# Altium schematic sheet 12V_FROM_BATTERY.SchDoc: DARKYDEN_12V_FROM_BATTERY
size Letter; ApprovedBy: APPROUVÉ PAR; Author: Harold Malbrouck; Organization: Cegep Limoilou; Address1: 1300, 8e Avenue; Address2: Québec, QC; Address3: Canada; Address4: G1J 5L5; Revision: Rev.A; SheetNumber: 18; SheetTotal: 22
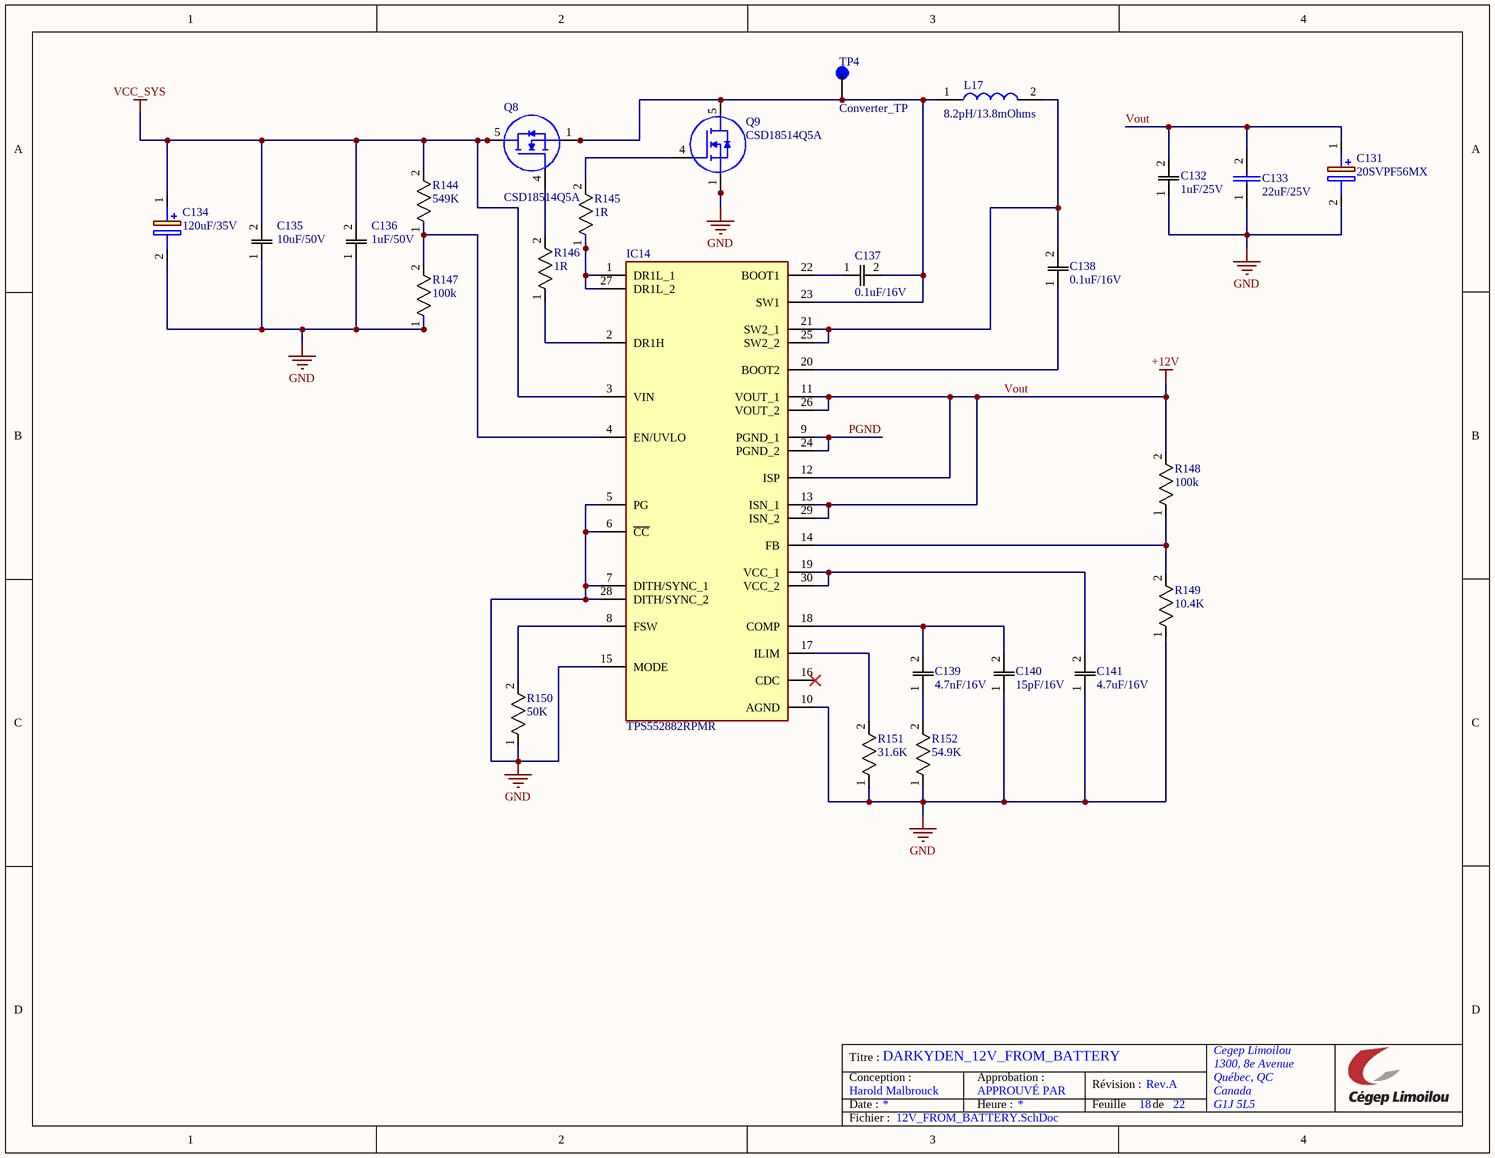
[diagram p0: 12V_FROM_BATTERY.SchDoc]

## Parts
C131  20SVPF56MX  [16SVF82M]
C132  1uF/25V  [C0805]
C133  22uF/25V  [CAPC3225X270N]
C134  120uF/35V  [16SVF1000M]
C135  10uF/50V  [CAPC3225X230N]
C136  1uF/50V  [CAPC1608X80N]
C137  0.1uF/16V  [CAPC220145_88N_KEM]
C138  0.1uF/16V  [CAPC220145_88N_KEM]
C139  4.7nF/16V  [CAPC220145_88N_KEM]
C140  15pF/16V  [CAPC220145_88N_KEM]
C141  4.7uF/16V  [C0805]
IC14  TPS552882RPMR  [TPS552882RPMR]
L17  8.2pH/13.8mOhms  [INDPM135126X650N]
Q8  CSD18514Q5A  [CSD18514Q5A]
Q9  CSD18514Q5A  [CSD18514Q5A]
R144  549K  [RC0603N_PAN]
R145  1R  [ERJ3EKF1000V]
R146  1R  [ERJ3EKF1000V]
R147  100k  [ERJ3EKF1000V]
R148  100k  [ERJ3EKF1000V]
R149  10.4K  [RC0603N_PAN]
R150  50K  [RESC1005X40N]
R151  31.6K  [RESC1005X40N]
R152  54.9K  [RESC1005X40N]
TP4  Converter_TP  [KEYSTONE_5006]

## Nets
GND: C131.2(-) C132.1 C133.1 C134.2(-) C135.1 C136.1 C140.1 C141.1 IC14.5(PG) IC14.6(~{CC}) IC14.7(DITH/SYNC_1) IC14.10(AGND) IC14.15(MODE) IC14.28(DITH/SYNC_2) R147.1 R149.1 R150.1 R151.1 R152.1
VCC_SYS: C134.1(+) C135.2 C136.2 IC14.3(VIN) Q8.5(D) Q8.6(D_2) Q8.7(D_3) Q8.8(D_4) Q8.9(D_5) R144.2
Vout: C131.1(+) C132.2 C133.2 IC14.11(VOUT_1) IC14.12(ISP) IC14.13(ISN_1) IC14.26(VOUT_2) IC14.29(ISN_2) R148.2  [also labelled +12V]
PGND: IC14.9(PGND_1) IC14.24(PGND_2)
NetC137_1: C137.1 IC14.22(BOOT1)
NetC137_2: C137.2 IC14.23(SW1) L17.1 Q8.1(S) Q8.2(S_2) Q8.3(S_3) Q9.5(D) Q9.6(D_2) Q9.7(D_3) Q9.8(D_4) Q9.9(D_5) TP4.TP
NetC138_1: C138.1 IC14.20(BOOT2)
NetC138_2: C138.2 IC14.21(SW2_1) IC14.25(SW2_2) L17.2
NetC139_1: C139.1 R152.2
NetC139_2: C139.2 C140.2 IC14.18(COMP)
NetC141_2: C141.2 IC14.19(VCC_1) IC14.30(VCC_2)
NetIC14_1: IC14.1(DR1L_1) IC14.27(DR1L_2) R145.1
NetIC14_2: IC14.2(DR1H) R146.1
NetIC14_4: IC14.4(EN/UVLO) R144.1 R147.2
NetIC14_8: IC14.8(FSW) R150.2
NetIC14_14: IC14.14(FB) R148.1 R149.2
NetIC14_17: IC14.17(ILIM) R151.2
NetQ8_4: Q8.4(G) R146.2
NetQ9_1: Q9.1(S) Q9.2(S_2) Q9.3(S_3)
NetQ9_4: Q9.4(G) R145.2

Not connected (* = marked no-connect by the designer): IC14 16(CDC)*

## Notes on the sheet
- Titre :
- Conception :
- Date :
- Approbation :
- Heure :
- Révision :
- Feuille
- de
- Fichier :

## Library data of the parts
C131 = 20SVPF56MX: 56uF 20VDC 20%( Cap Aluminum Polymer SMD 0.03 Ohm 2800mA 5000h 105C T/R; Manufacturer_Name: Panasonic; ESR (Equivalent Series Resistance): 30mR; Ripple Current: 2.8A; Voltage Rating: 20V; Leakage Current: 224uA; Life (Hours): 5000Hour; Dissipation Factor: 12%; Datasheet Link: http://industrial.panasonic.com/cdbs/www-data/pdf/AAB8000/AAB8000C177.pdf; Height: 6mm; Manufacturer_Part_Number: 20SVPF56MX; Mouser Part Number: 667-20SVPF56MX; Mouser Price/Stock: https://www.mouser.co.uk/ProductDetail/Panasonic/20SVPF56MX?qs=OE1iw1LrrPFJ8spd6yzaew%3D%3D; Arrow Part Number: 20SVPF56MX; Arrow Price/Stock: https://www.arrow.com/en/products/20svpf56mx/panasonic?region=nac; Supplier: Digikey; Supplier Part Number: P16502CT-ND; Manufacturer: Panasonic; Manufacturer Part Number: 20SVPF56MX; RoHS: Yes; Category: Polymer Capacitors; Stock: 2410; Pricing: 1=0.84, 10=0.481, 50=0.473, 100=0.453, 500=0.407 (USD); Mounting Technology: Surface Mount; Case/Package: Radial; Pins: 6; Min Operating Temperature: -55°C; Max Operating Temperature: 105°C; Value: 56uF; Tolerance: 20%; Packaging: Tape and Reel; Ripple Current (AC): 2.8A; Package Quantity: 1500; Voltage Rating (DC): 20V; Termination: SMD/SMT; Voltage: 20V; Series: OS-CON™, SVPF; Diameter: 5mm; Length: 5.9mm; Reach SVHC Compliant: No; RoHS Compliant: Yes; ComponentLink1URL: https://datasheet.ciiva.com/25746/1734360-25746730.pdf?src-supplier=Farnell; ComponentLink1Description: https://datasheet.ciiva.com/25746/1734360-25746730.pdf?src-supplier=Farnell; ComponentLink2URL: https://datasheet.ciiva.com/24066/svpf-os-262415-24066271.pdf?src-supplier=Mouser; ComponentLink2Description: https://datasheet.ciiva.com/24066/svpf-os-262415-24066271.pdf?src-supplier=Mouser; ComponentLink3URL: https://datasheet.ciiva.com/48542/svpf-eng-ds-48542383.pdf?src-supplier=Distrelec; ComponentLink3Description: https://datasheet.ciiva.com/48542/svpf-eng-ds-48542383.pdf?src-supplier=Distrelec
C132 = C0805C105K3RACTU: 1 µF, 25 V (DC), ±10 %, SMD 0805, X7R, C0805C105K3RAC7800; Manufacturer_Name: KEMET; Dielectric Material: Ceramic; Material: 4241ConductorMaterial; Value: 1uF; Tolerance: 10%; Voltage: 25V; Datasheet Link: https://content.kemet.com/datasheets/KEM_C1002_X7R_SMD.pdf; Height: 1.1mm; Manufacturer_Part_Number: C0805C105K3RACTU; Mouser Part Number: 80-C0805C105K3R; Mouser Price/Stock: https://www.mouser.co.uk/ProductDetail/KEMET/C0805C105K3RACTU?qs=7V%2FSUxyM1Kfm2X%2FN09twSA%3D%3D; Arrow Part Number: C0805C105K3RACTU; Arrow Price/Stock: https://www.arrow.com/en/products/c0805c105k3ractu/kemet-corporation?region=nac; Supplier: Digikey; Supplier Part Number: 399-C0805C105K3RACTUCT-ND; Manufacturer: KEMET; Manufacturer Part Number: C0805C105K3RACTU; RoHS: Yes; Category: Ceramic Capacitors; Stock: 127373; Pricing: 1=0.61, 10=0.498, 100=0.376, 1000=0.30337 (USD); Mounting Technology: Surface Mount; Case/Package: 0805; Pins: 2; Case Code (Imperial): 0805; Case Code (Metric): 2012; Min Operating Temperature: -55°C; Max Operating Temperature: 125°C; Dielectric: X7R; Packaging: Tape and Reel; Termination: SMD/SMT; Package Quantity: 2500; Voltage Rating: 25V; Voltage Rating (DC): 25V; Series: C; Construction: Flat; Length: 2mm; Width: 0.049inch; Depth: 1.25mm; Thickness: 0.055inch; Radiation Hardening: No; Reach SVHC Compliant: No; RoHS Compliant: Yes
C133 = GRM32ER61E226KE15L: 1210 22 uF 25 V ±10% Tolerance X5R SMT Multilayer Ceramic Capacitor; Manufacturer_Name: Murata Electronics; Manufacturer: Murata; Value: 22uF; Voltage Rating: 25V; Datasheet Link: https://search.murata.co.jp/Ceramy/image/img/A01X/G101/ENG/GRM32ER61E226KE15-01A.pdf; Height: 2.7mm; Manufacturer_Part_Number: GRM32ER61E226KE15L; Mouser Part Number: 81-GRM32ER61E226KE15; Mouser Price/Stock: https://www.mouser.co.uk/ProductDetail/Murata-Electronics/GRM32ER61E226KE15L?qs=CHiu0TXTCq%252Bo%252Bcqcz70txw%3D%3D; Arrow Part Number: GRM32ER61E226KE15L; Arrow Price/Stock: https://www.arrow.com/en/products/grm32er61e226ke15l/murata-manufacturing?utm_currency=USD&region=nac; Supplier: Digikey; Supplier Part Number: 490-3889-1-ND; Manufacturer Part Number: GRM32ER61E226KE15L; RoHS: Yes; Category: Ceramic Capacitors; Stock: 470491; Pricing: 1=1.44, 10=1.213, 100=0.9457 (USD); Mounting Technology: Surface Mount; Case/Package: 1210; Pins: 2; Case Code (Metric): 3225; Case Code (Imperial): 1210; Material: Ceramic; Min Operating Temperature: -55°C; Max Operating Temperature: 85°C; Package Quantity: 1; Tolerance: 10%; Packaging: Tape and Reel; Voltage Rating (DC): 25V; Dielectric: X5R; Termination: SMD/SMT; Voltage: 25V; Series: GRM; Construction: Flat; Length: 3.2mm; Width: 2.5mm; Thickness: 0.106inch; Depth: 2.5mm; Reach SVHC Compliant: No; Lead Free: Lead Free; RoHS Compliant: Yes; ComponentLink1URL: https://datasheet.ciiva.com/143/product-143250.pdf?src-supplier=Digikey; ComponentLink1Description: https://datasheet.ciiva.com/143/product-143250.pdf?src-supplier=Digikey; ComponentLink2URL: https://datasheet.ciiva.com/3777/2725grm32er61e226ke1523-3777196.pdf?src-supplier=Arrow+Electronics; ComponentLink2Description: https://datasheet.ciiva.com/3777/2725grm32er61e226ke1523-3777196.pdf?src-supplier=Arrow+Electronics; ComponentLink3URL: https://datasheet.ciiva.com/11787/0900766b80ef921d-11787889.pdf?src-supplier=Rs; ComponentLink3Description: https://datasheet.ciiva.com/11787/0900766b80ef921d-11787889.pdf?src-supplier=Rs; ComponentLink4URL: https://datasheet.ciiva.com/143/grm32er61e226ke15-01-143251.pdf?src-supplier=Digikey; ComponentLink4Description: https://datasheet.ciiva.com/143/grm32er61e226ke15-01-143251.pdf?src-supplier=Digikey; ComponentLink5URL: https://datasheet.ciiva.com/143/grm32er61e226ke15-01-143252.pdf?src-supplier=Digikey; ComponentLink5Description: https://datasheet.ciiva.com/143/grm32er61e226ke15-01-143252.pdf?src-supplier=Digikey; ComponentLink6URL: https://datasheet.ciiva.com/2989/product-2989817.pdf?src-supplier=Avnet; ComponentLink6Description: https://datasheet.ciiva.com/2989/product-2989817.pdf?src-supplier=Avnet; ComponentLink7URL: https://datasheet.ciiva.com/2989/product-2989818.pdf?src-supplier=Avnet; ComponentLink7Description: https://datasheet.ciiva.com/2989/product-2989818.pdf?src-supplier=Avnet; ComponentLink8URL: https://datasheet.ciiva.com/16348/l0006e-16348889.pdf?src-supplier=Future+Electronics; ComponentLink8Description: https://datasheet.ciiva.com/16348/l0006e-16348889.pdf?src-supplier=Future+Electronics; ComponentLink9URL: https://datasheet.ciiva.com/7719/608985-7719195.pdf?src-supplier=Element14; ComponentLink9Description: https://datasheet.ciiva.com/7719/608985-7719195.pdf?src-supplier=Element14; ComponentLink10URL: https://datasheet.ciiva.com/14116/grmseries-highdielectrictype-eng-14116379.pdf?src-supplier=Distrelec; ComponentLink10Description: https://datasheet.ciiva.com/14116/grmseries-highdielectrictype-eng-14116379.pdf?src-supplier=Distrelec; ComponentLink11URL: https://datasheet.ciiva.com/22706/608985-22706873.pdf?src-supplier=Element14; ComponentLink11Description: https://datasheet.ciiva.com/22706/608985-22706873.pdf?src-supplier=Element14
C134 = 35SVPF120M: 120uF 35VDC 20% Cap Aluminum Polymer   SMD 0.018 Ohm 4400mA 5000h 105C T/R; Manufacturer_Name: Panasonic; Voltage Rating: 35V; ESR (Equivalent Series Resistance): 18mR; Ripple Current: 4.4A; Leakage Current: 840uA; Life (Hours): 5000Hour; Dissipation Factor: 12%; Datasheet Link: http://industrial.panasonic.com/cdbs/www-data/pdf/AAB8000/AAB8000C177.pdf; Height: 12.7mm; Manufacturer_Part_Number: 35SVPF120M; Mouser Part Number: 667-35SVPF120M; Mouser Price/Stock: https://www.mouser.co.uk/ProductDetail/Panasonic/35SVPF120M?qs=OE1iw1LrrPEMtY1ZtoIEvg%3D%3D; Arrow Part Number: 35SVPF120M; Arrow Price/Stock: https://www.arrow.com/en/products/35svpf120m/panasonic?utm_currency=USD&region=nac; Supplier: Digikey; Supplier Part Number: P16559CT-ND; Manufacturer: Panasonic; Manufacturer Part Number: 35SVPF120M; RoHS: Yes; Category: Polymer Capacitors; Stock: 8642; Pricing: 1=2.52, 10=1.63, 50=1.35, 100=1.2 (USD); Mounting Technology: Surface Mount,PCB; Case/Package: Radial; Pins: 12; Material: Polymer; Min Operating Temperature: -55°C; Max Operating Temperature: 105°C; Package Quantity: 400; Packaging: Tape and Reel; Value: 120uF; Tolerance: 20%; Voltage Rating (DC): 35V; Ripple Current (AC): 4.4A; Termination: SMD/SMT; Voltage: 35V; Series: OS-CON™, SVPF; Diameter: 10mm; Length: 12.6mm; Reach SVHC Compliant: No; Lead Free: Lead Free; RoHS Compliant: Yes; ComponentLink1URL: https://datasheet.ciiva.com/25761/1734360-25761535.pdf?src-supplier=Farnell; ComponentLink1Description: https://datasheet.ciiva.com/25761/1734360-25761535.pdf?src-supplier=Farnell; ComponentLink2URL: https://datasheet.ciiva.com/24094/svpf-os-262415-24094351.pdf?src-supplier=Mouser; ComponentLink2Description: https://datasheet.ciiva.com/24094/svpf-os-262415-24094351.pdf?src-supplier=Mouser; ComponentLink3URL: https://datasheet.ciiva.com/48542/svpf-eng-ds-48542424.pdf?src-supplier=Distrelec; ComponentLink3Description: https://datasheet.ciiva.com/48542/svpf-eng-ds-48542424.pdf?src-supplier=Distrelec; ComponentLink4URL: https://datasheet.ciiva.com/49032/70324301-49032503.pdf?src-supplier=Allied+Electronics; ComponentLink4Description: https://datasheet.ciiva.com/49032/70324301-49032503.pdf?src-supplier=Allied+Electronics; ComponentLink5URL: https://datasheet.ciiva.com/22746/1734360-22746250.pdf?src-supplier=Element14; ComponentLink5Description: https://datasheet.ciiva.com/22746/1734360-22746250.pdf?src-supplier=Element14
C135 = C3225X7R1H106M250AC: 10 uF 50 V 1210 ±20 % Tolerance X7R SMT Multilayer Ceramic Capacitor; Manufacturer_Name: TDK; Value: 10uF; Tolerance: 20%; Voltage Rating: 50V; Datasheet Link: https://product.tdk.com/info/en/catalog/datasheets/mlcc_commercial_midvoltage_en.pdf; Height: 2.3mm; Manufacturer_Part_Number: C3225X7R1H106M250AC; Mouser Part Number: 810-C3225X7R1H106MAC; Mouser Price/Stock: https://www.mouser.co.uk/ProductDetail/TDK/C3225X7R1H106M250AC?qs=6JAMGB%252BEdkwY95l8JqNSnw%3D%3D; Arrow Part Number: C3225X7R1H106M250AC; Arrow Price/Stock: https://www.arrow.com/en/products/c3225x7r1h106m250ac/tdk?region=nac; Supplier: Digikey; Supplier Part Number: 445-14933-1-ND; Manufacturer: TDK; Manufacturer Part Number: C3225X7R1H106M250AC; RoHS: Yes; Category: Ceramic Capacitors; Stock: 7078; Pricing: 1=0.96, 10=0.612, 100=0.4336 (USD); Mounting Technology: Surface Mount; Case/Package: 1210; Case Code (Metric): 3225; Case Code (Imperial): 1210; Weight: 0.000564oz; Dielectric Material: Ceramic; Material: Ceramic; Min Operating Temperature: -55°C; Max Operating Temperature: 125°C; Package Quantity: 1000; Packaging: Tape and Reel; Dielectric: X7R; Termination: SMD/SMT; Voltage Rating (DC): 50V; Series: C; Length: 0.126inch; Width: 0.098inch; Thickness: 0.11inch; Reach SVHC Compliant: No; Lead Free: Lead Free; RoHS Compliant: Yes; ComponentLink1URL: http://www.farnell.com/datasheets/2792994.pdf?src-supplier=Farnell; ComponentLink1Description: http://www.farnell.com/datasheets/2792994.pdf?src-supplier=Farnell; ComponentLink2URL: http://www.mouser.com/ds/2/400/tdk_mlcc_commercial_general_en-542463.pdf?src-supplier=Mouser; ComponentLink2Description: http://www.mouser.com/ds/2/400/tdk_mlcc_commercial_general_en-542463.pdf?src-supplier=Mouser; ComponentLink3URL: https://product.tdk.com/info/en/documents/chara_sheet/C3225X7R1H106M250AC.pdf?src-supplier=Digikey; ComponentLink3Description: https://product.tdk.com/info/en/documents/chara_sheet/C3225X7R1H106M250AC.pdf?src-supplier=Digikey; ComponentLink4URL: http://product.tdk.com/capacitor/mlcc/en/documents/mlcc_commercial_general_en.pdf?src-supplier=Avnet; ComponentLink4Description: http://product.tdk.com/capacitor/mlcc/en/documents/mlcc_commercial_general_en.pdf?src-supplier=Avnet; ComponentLink5URL: http://www.farnell.com/datasheets/2291921.pdf?src-supplier=Newark; ComponentLink5Description: http://www.farnell.com/datasheets/2291921.pdf?src-supplier=Newark; ComponentLink6URL: https://datasheet.octopart.com/C3225X7R1H106M250AC-TDK-datasheet-14433597.pdf?src-supplier=Future+Electronics; ComponentLink6Description: https://datasheet.octopart.com/C3225X7R1H106M250AC-TDK-datasheet-14433597.pdf?src-supplier=Future+Electronics
C136 = C1608X5R1H105K080AB: 1uF / 50 V, X5R,  Surface Mount, 0603; Manufacturer_Name: TDK; Material: Ceramic; Dielectric Material: 4241ConductorMaterial; Tolerance: 10%; Voltage Rating: 50V; Datasheet Link: https://product.tdk.com/info/en/catalog/datasheets/mlcc_commercial_midvoltage_en.pdf; Height: 0.8mm; Manufacturer_Part_Number: C1608X5R1H105K080AB; Mouser Part Number: 810-C1608X5R1H105K; Mouser Price/Stock: https://www.mouser.co.uk/ProductDetail/TDK/C1608X5R1H105K080AB?qs=NRhsANhppD%252BLmxnPDqAv3A%3D%3D; Arrow Part Number: C1608X5R1H105K080AB; Arrow Price/Stock: https://www.arrow.com/en/products/c1608x5r1h105k080ab/tdk?region=nac; Supplier: Digikey; Supplier Part Number: 445-7468-1-ND; Manufacturer: TDK; Manufacturer Part Number: C1608X5R1H105K080AB; RoHS: Yes; Category: Ceramic Capacitors; Stock: 19911; Pricing: 1=0.15, 10=0.086, 100=0.0526, 1000=0.03552 (USD); Mounting Technology: Surface Mount; Case/Package: 0603; Pins: 2; Case Code (Metric): 1608; Case Code (Imperial): 0603; Min Operating Temperature: -55°C; Max Operating Temperature: 85°C; Value: 1uF; Packaging: Tape and Reel; Package Quantity: 1; Dielectric: X5R; Voltage: 50V; Series: C; Construction: Flat; Length: 1.6mm; Width: 0.031inch; Thickness: 0.035inch; Depth: 0.8mm; Reach SVHC Compliant: No; Lead Free: Lead Free; RoHS Compliant: Yes; ComponentLink1URL: https://datasheet.ciiva.com/6291/tdkmlcccaprange-6291880.pdf?src-supplier=Digikey; ComponentLink1Description: https://datasheet.ciiva.com/6291/tdkmlcccaprange-6291880.pdf?src-supplier=Digikey; ComponentLink2URL: https://datasheet.ciiva.com/22694/1796654-22694122.pdf?src-supplier=Element14; ComponentLink2Description: https://datasheet.ciiva.com/22694/1796654-22694122.pdf?src-supplier=Element14
C137 C138 = C0805C104K4RACAUTO: 0.1uF/16V ±10% X7R 0805 (2012METRIC) Ceramic Capacitor SMD Auto X7R; Mfr_Name: Kemet; Material: 4241ConductorMaterial; Value: 100nF; Temperature Coefficient: 30ppm/°C; Voltage Rating: 16V; Supplier: Digikey; Supplier Part Number: 399-C0805C104K4RACAUTOCT-ND; Manufacturer: KEMET; Manufacturer Part Number: C0805C104K4RACAUTO; RoHS: Yes; Category: Ceramic Capacitors; Stock: 27573; Pricing: 1=0.19, 10=0.108, 100=0.0672, 1000=0.04624 (USD); Case/Package: 0805; Dielectric Material: 4241ConductorMaterial; Min Operating Temperature: -55°C; Max Operating Temperature: 125°C; Tolerance: 10%; Packaging: Tape and Reel; Dielectric: X7R; Voltage Rating (DC): 16V; Length: 2mm; Depth: 1.25mm; RoHS Compliant: Yes
C139 = C0805C472K4RACTU: 4.7nF, 16VDC, 10-% Tol, 10+% Tol, X7R-TC Code, -15, 15%-TC RoHS Compliant: Yes; Mfr_Name: Kemet; Dielectric Material: Ceramic; Tolerance: 10%; Voltage Rating (DC): 16V; Dielectric: X7R; Supplier: Digikey; Supplier Part Number: 399-C0805C472K4RACTUCT-ND; Manufacturer: KEMET; Manufacturer Part Number: C0805C472K4RACTU; RoHS: Yes; Category: Ceramic Capacitors; Stock: 8963; Pricing: 1=0.26, 10=0.151, 100=0.0965, 1000=0.06823 (USD); Mounting Technology: Surface Mount; Case/Package: 0805; Case Code (Metric): 2012; Case Code (Imperial): 0805; Weight: 0.000194oz; Min Operating Temperature: -55°C; Max Operating Temperature: 125°C; Value: 4.7nF; Packaging: Tape and Reel; Package Quantity: 4000; Voltage Rating: 16V; Termination: SMD/SMT; Series: C; Length: 2mm; Width: 1.2mm; Depth: 1.25mm; Thickness: 0.035inch; RoHS Compliant: Yes; ComponentLink1URL: http://www.mouser.com/ds/2/212/KEM_C1002_X7R_SMD-1102033.pdf?src-supplier=Mouser; ComponentLink1Description: http://www.mouser.com/ds/2/212/KEM_C1002_X7R_SMD-1102033.pdf?src-supplier=Mouser; ComponentLink2URL: http://components.arrow.com/part/dataview/3449985S6352420N7429?src-supplier=Arrow+Electronics; ComponentLink2Description: http://components.arrow.com/part/dataview/3449985S6352420N7429?src-supplier=Arrow+Electronics; ComponentLink3URL: http://www.kemet.com/docfinder?Partnumber=C0805C472K4RACTU&src-supplier=Digikey; ComponentLink3Description: http://www.kemet.com/docfinder?Partnumber=C0805C472K4RACTU&src-supplier=Digikey
C140 = C0805C150K4GACTU: 15 pF, 16 V, ± 10%, C0G (NP0), 0805 [2012 Metric]; Mfr_Name: Kemet; Dielectric Material: Ceramic; Value: 15pF; Voltage Rating (DC): 16V; Supplier: Digikey; Supplier Part Number: 399-C0805C150K4GACTUCT-ND; Manufacturer: KEMET; Manufacturer Part Number: C0805C150K4GACTU; RoHS: Yes; Category: Ceramic Capacitors; Stock: 7321; Pricing: 1=0.22, 10=0.124, 100=0.078, 1000=0.05429 (USD); Mounting Technology: Surface Mount; Case/Package: 0805; Case Code (Imperial): 0805; Case Code (Metric): 2012; Min Operating Temperature: -55°C; Max Operating Temperature: 125°C; Tolerance: 10%; Dielectric: C0G; Package Quantity: 4000; Packaging: Tape and Reel; Voltage Rating: 16V; Termination: SMD/SMT; Series: SMD Comm C0G; Length: 2mm; Height: 0.78mm; Depth: 1.25mm; Lead Pitch: 0.75mm; Lead Free: Lead Free; RoHS Compliant: Yes; ComponentLink1URL: https://datasheet.ciiva.com/5412/kem-c1003-c0g-smd-5412789.pdf?src-supplier=Mouser; ComponentLink1Description: https://datasheet.ciiva.com/5412/kem-c1003-c0g-smd-5412789.pdf?src-supplier=Mouser
C141 = C0805C475K4RACTU: 4.7 uF, 16 V, ± 10%, X7R, 0805 [2012 Metric]; Manufacturer_Name: KEMET; Dielectric Material: Ceramic; Material: 4241ConductorMaterial; Value: 4.7uF; Voltage Rating: 16V; Dissipation Factor: 5%; Datasheet Link: https://content.kemet.com/datasheets/KEM_C1002_X7R_SMD.pdf; Height: 1.1mm; Manufacturer_Part_Number: C0805C475K4RACTU; Mouser Part Number: 80-C0805C475K4R; Mouser Price/Stock: https://www.mouser.co.uk/ProductDetail/KEMET/C0805C475K4RACTU?qs=iP0bYSAMAFomlmlmK2IJkg%3D%3D; Arrow Part Number: C0805C475K4RACTU; Arrow Price/Stock: https://www.arrow.com/en/products/c0805c475k4ractu/kemet-corporation?region=nac; Supplier: Digikey; Supplier Part Number: 399-C0805C475K4RACTUCT-ND; Manufacturer: KEMET; Manufacturer Part Number: C0805C475K4RACTU; RoHS: Yes; Category: Ceramic Capacitors; Stock: 21230; Pricing: 1=0.23, 10=0.131, 100=0.1203, 1000=0.10305 (USD); Mounting Technology: Surface Mount; Case/Package: 0805; Case Code (Metric): 2012; Case Code (Imperial): 0805; Min Operating Temperature: -55°C; Max Operating Temperature: 125°C; Packaging: Tape and Reel; Tolerance: 10%; Package Quantity: 1; Voltage Rating (DC): 16V; Dielectric: X7R; Termination: SMD/SMT; Voltage: 16V; Series: C; Length: 2mm; Width: 0.049inch; Thickness: 0.055inch; Depth: 1.25mm; Reach SVHC Compliant: No; RoHS Compliant: Yes; ComponentLink1URL: https://datasheet.ciiva.com/28682/1851736-28682348.pdf?src-supplier=Element14; ComponentLink1Description: https://datasheet.ciiva.com/28682/1851736-28682348.pdf?src-supplier=Element14; ComponentLink2URL: https://datasheet.ciiva.com/5408/kem-c1002-x7r-smd-5408584.pdf?src-supplier=Mouser; ComponentLink2Description: https://datasheet.ciiva.com/5408/kem-c1002-x7r-smd-5408584.pdf?src-supplier=Mouser
IC14 = TPS552882RPMR: 36-V, 16-A buck-boost converter 26-VQFN-HR -40 to 125; Manufacturer_Name: Texas Instruments; Datasheet Link: https://www.ti.com/lit/gpn/TPS552882; Height: 1mm; Manufacturer_Part_Number: TPS552882RPMR; Mouser Part Number: 595-TPS552882RPMR; Mouser Price/Stock: https://www.mouser.co.uk/ProductDetail/Texas-Instruments/TPS552882RPMR?qs=81r%252BiQLm7BSBLProFZmPCQ%3D%3D; Arrow Part Number: TPS552882RPMR; Arrow Price/Stock: https://www.arrow.com/en/products/tps552882rpmr/texas-instruments?utm_currency=USD&region=nac; Supplier: Digikey; Supplier Part Number: 296-TPS552882RPMRCT-ND; Manufacturer: Texas Instruments; Manufacturer Part Number: TPS552882RPMR; RoHS: Yes; Category: Voltage Regulators - Switching; Stock: 2434; Pricing: 1=6.03, 10=4.623, 25=4.2716, 100=3.8854, 250=3.70124, 500=3.59024, 1000=3.49889 (USD)
L17 = PA4343.822ANLT: Inductor Power Shielded/Molded Wirewound 8.2uH 20% 100KHz 15A 0.0138Ohm DCR Automotive T/R; Manufacturer_Name: Pulse Electronics; Manufacturer: Pulse; Datasheet Link: http://products.pulseelex.com/files/product_files/P793_782.pdf; Height: 6.5mm; Manufacturer_Part_Number: PA4343.822ANLT; Mouser Part Number: 673-PA4343.822ANLT; Mouser Price/Stock: https://www.mouser.co.uk/ProductDetail/Pulse-Electronics/PA4343.822ANLT?qs=chTDxNqvsym%252BqHcAYy%2ForA%3D%3D; Arrow Part Number: PA4343.822ANLT; Arrow Price/Stock: https://www.arrow.com/en/products/pa4343.822anlt/pulse-electronics-corporation?region=nac; Supplier: Digikey; Supplier Part Number: 553-4028-1-ND; Manufacturer Part Number: PA4343.822ANLT; RoHS: Yes; Category: Fixed Inductors; Stock: 1844; Pricing: 1=1.62, 10=1.331, 100=1.0943 (USD); Value: 8.2uH; ComponentLink1URL: http://www.farnell.com/datasheets/2675079.pdf?src-supplier=Farnell; ComponentLink1Description: http://www.farnell.com/datasheets/2675079.pdf?src-supplier=Farnell; ComponentLink2URL: http://www.farnell.com/datasheets/2675079.pdf?src-supplier=Newark; ComponentLink2Description: http://www.farnell.com/datasheets/2675079.pdf?src-supplier=Newark; ComponentLink3URL: https://datasheet.octopart.com/PA4343.822ANLT-Pulse-datasheet-168964606.pdf?src-supplier=Master+Electronics; ComponentLink3Description: https://datasheet.octopart.com/PA4343.822ANLT-Pulse-datasheet-168964606.pdf?src-supplier=Master+Electronics
Q8 Q9 = CSD18514Q5A: MOSFET N-Channel 40 V 89A (Tc) 74W (Tc) Surface Mount 8-VSONP (5x6); Manufacturer_Name: Texas Instruments; Datasheet Link: http://www.ti.com/lit/gpn/csd18514q5a; Height: 1.1mm; Manufacturer_Part_Number: CSD18514Q5A; Mouser Part Number: 595-CSD18514Q5A; Mouser Price/Stock: https://www.mouser.co.uk/ProductDetail/Texas-Instruments/CSD18514Q5A?qs=34RfhUjJmKfubXTJ%252BbkIEA%3D%3D; Arrow Part Number: CSD18514Q5A; Arrow Price/Stock: https://www.arrow.com/en/products/csd18514q5a/texas-instruments?region=nac
R144 = ERJ-3EKF5493V: 549 kOhm, ± 1%, 100 mW, 0603 [1608 Metric], Thick Film, Precision; Mfr_Name: Panasonic; Value: 549kR; Power Rating: 100mW; Voltage Rating: 75V; Temperature Coefficient: 100ppm/°C; Voltage Rating (DC): 50V; Supplier: Digikey; Supplier Part Number: P549KHCT-ND; Manufacturer: Panasonic; Manufacturer Part Number: ERJ-3EKF5493V; RoHS: Yes; Category: Chip SMD Resistors; Stock: 30224; Pricing: 1=0.1, 10=0.035, 100=0.0177, 1000=0.01014, 2500=0.00847 (USD); Mounting Technology: Surface Mount; Case/Package: 0603; Case Code (Metric): 1608; Case Code (Imperial): 0603; Contact Plating: Tin; Min Operating Temperature: -55°C; Max Operating Temperature: 155°C; Packaging: Tape and Reel; Tolerance: 1%; Package Quantity: 1; Resistor Type: Thick Film; Number of Terminations: 2; Termination: SMD/SMT; Max Power Dissipation: 100mW; Series: ERJ; Resistance Tolerance: 1%; Technology: THICK FILM; Construction: Rectangular; Length: 1.6mm; Width: 0.8mm; Height: 0.45mm; Depth: 0.8mm; Radiation Hardening: No; Reach SVHC Compliant: No; Military Standard: Not; Lead Free: Contains Lead; RoHS Compliant: Yes; ComponentLink1URL: https://datasheet.ciiva.com/5959/426256-5959704.pdf?src-supplier=Farnell; ComponentLink1Description: https://datasheet.ciiva.com/5959/426256-5959704.pdf?src-supplier=Farnell; ComponentLink2URL: https://datasheet.ciiva.com/9181/aoa0000ce2-9181213.pdf?src-supplier=Avnet; ComponentLink2Description: https://datasheet.ciiva.com/9181/aoa0000ce2-9181213.pdf?src-supplier=Avnet; ComponentLink3URL: https://datasheet.ciiva.com/24071/aoa0000ce2-24071311.pdf?src-supplier=Mouser; ComponentLink3Description: https://datasheet.ciiva.com/24071/aoa0000ce2-24071311.pdf?src-supplier=Mouser; ComponentLink4URL: https://datasheet.ciiva.com/28564/1678782-28564261.pdf?src-supplier=Element14; ComponentLink4Description: https://datasheet.ciiva.com/28564/1678782-28564261.pdf?src-supplier=Element14; ComponentLink5URL: https://datasheet.ciiva.com/28683/1678782-28683215.pdf?src-supplier=Element14; ComponentLink5Description: https://datasheet.ciiva.com/28683/1678782-28683215.pdf?src-supplier=Element14; ComponentLink6URL: https://datasheet.ciiva.com/46388/426256-46388763.pdf?src-supplier=Element14; ComponentLink6Description: https://datasheet.ciiva.com/46388/426256-46388763.pdf?src-supplier=Element14; ComponentLink7URL: https://datasheet.ciiva.com/16766/70260748-16766054.pdf?src-supplier=Allied+Electronics; ComponentLink7Description: https://datasheet.ciiva.com/16766/70260748-16766054.pdf?src-supplier=Allied+Electronics; ComponentLink8URL: https://datasheet.ciiva.com/16766/70260748-16766423.pdf?src-supplier=Allied+Electronics; ComponentLink8Description: https://datasheet.ciiva.com/16766/70260748-16766423.pdf?src-supplier=Allied+Electronics
R145 R146 = ERJ-3GEYJ1R0V: 1 Ohm 5% 1/10W  Res Thick Film 0603 -100ppm/ to 600|; Manufacturer_Name: Panasonic; Temperature Coefficient: 600ppm/°C; Power Rating: 100mW; Voltage Rating: 75V; Voltage Rating (DC): 50V; Datasheet Link: http://docs-europe.electrocomponents.com/webdocs/13ba/0900766b813ba21b.pdf; Height: 0.55mm; Manufacturer_Part_Number: ERJ-3GEYJ1R0V; Mouser Part Number: 667-ERJ-3GEYJ1R0V; Mouser Price/Stock: https://www.mouser.co.uk/ProductDetail/Panasonic/ERJ-3GEYJ1R0V?qs=iBwFsHVUAOehrcsQVhVEKg%3D%3D; Supplier: Digikey; Supplier Part Number: P1.0GCT-ND; Manufacturer: Panasonic; Manufacturer Part Number: ERJ-3GEYJ1R0V; RoHS: Yes; Category: Chip SMD Resistors; Stock: 374695; Pricing: 1=0.1, 10=0.033, 50=0.02, 100=0.0165, 500=0.01096, 1000=0.00939 (USD); Mounting Technology: Surface Mount; Case/Package: 0603; Case Code (Metric): 1608; Case Code (Imperial): 0603; Contact Plating: Tin; Min Operating Temperature: -55°C; Max Operating Temperature: 155°C; Value: 1R; Tolerance: 5%; Packaging: Tape and Reel; Technology: THICK FILM; Package Quantity: 1; Resistor Type: Thick Film; Number of Terminations: 2; Termination: SMD/SMT; Max Power Dissipation: 100mW; Features: Automotive AEC-Q200; Series: ERJ; Resistance Tolerance: 5%; Construction: Rectangular; Length: 1.6mm; Width: 0.8mm; Depth: 0.8mm; Radiation Hardening: No; Reach SVHC Compliant: No; Military Standard: Not; Lead Free: Lead Free; RoHS Compliant: Yes; ComponentLink1URL: https://datasheet.ciiva.com/11821/0900766b80f806dd-11821429.pdf?src-supplier=Rs; ComponentLink1Description: https://datasheet.ciiva.com/11821/0900766b80f806dd-11821429.pdf?src-supplier=Rs; ComponentLink2URL: https://datasheet.ciiva.com/6138/1678796-6138719.pdf?src-supplier=Farnell; ComponentLink2Description: https://datasheet.ciiva.com/6138/1678796-6138719.pdf?src-supplier=Farnell; ComponentLink3URL: https://datasheet.ciiva.com/43460/1678796-43460648.pdf?src-supplier=Farnell; ComponentLink3Description: https://datasheet.ciiva.com/43460/1678796-43460648.pdf?src-supplier=Farnell; ComponentLink4URL: https://datasheet.ciiva.com/9117/aoa0000ce1-9117101.pdf?src-supplier=Avnet; ComponentLink4Description: https://datasheet.ciiva.com/9117/aoa0000ce1-9117101.pdf?src-supplier=Avnet; ComponentLink5URL: https://datasheet.ciiva.com/27055/1988567-27055708.pdf?src-supplier=Jameco; ComponentLink5Description: https://datasheet.ciiva.com/27055/1988567-27055708.pdf?src-supplier=Jameco; ComponentLink6URL: https://datasheet.ciiva.com/30244/4aoa0000ce1-30244602.pdf?src-supplier=Onlinecomponents.com; ComponentLink6Description: https://datasheet.ciiva.com/30244/4aoa0000ce1-30244602.pdf?src-supplier=Onlinecomponents.com; ComponentLink7URL: https://datasheet.ciiva.com/28547/1678796-28547208.pdf?src-supplier=Element14; ComponentLink7Description: https://datasheet.ciiva.com/28547/1678796-28547208.pdf?src-supplier=Element14; ComponentLink8URL: https://datasheet.ciiva.com/28691/1678796-28691949.pdf?src-supplier=Element14; ComponentLink8Description: https://datasheet.ciiva.com/28691/1678796-28691949.pdf?src-supplier=Element14; ComponentLink9URL: https://datasheet.ciiva.com/16761/70255313-16761183.pdf?src-supplier=Allied+Electronics; ComponentLink9Description: https://datasheet.ciiva.com/16761/70255313-16761183.pdf?src-supplier=Allied+Electronics; ComponentLink10URL: https://datasheet.ciiva.com/16784/70255313-16784679.pdf?src-supplier=Allied+Electronics; ComponentLink10Description: https://datasheet.ciiva.com/16784/70255313-16784679.pdf?src-supplier=Allied+Electronics
R147 R148 = ERJ-3GEYJ104V: 100K Ohm 5%  Res Thick Film 0603 1/10W +/-200ppm/ßC Molded SMD Punched Carrier T/R; Manufacturer_Name: Panasonic; Value: 100kR; Power Rating: 100mW; Voltage Rating: 75V; Temperature Coefficient: 200ppm/°C; Voltage Rating (DC): 50V; Datasheet Link: http://docs-europe.electrocomponents.com/webdocs/13ba/0900766b813ba21b.pdf; Height: 0.55mm; Manufacturer_Part_Number: ERJ-3GEYJ104V; Mouser Part Number: 667-ERJ-3GEYJ104V; Mouser Price/Stock: https://www.mouser.co.uk/ProductDetail/Panasonic/ERJ-3GEYJ104V?qs=66DK8nO8gJC7IhSuep78kw%3D%3D; Arrow Part Number: ERJ-3GEYJ104V; Arrow Price/Stock: https://www.arrow.com/en/products/erj-3geyj104v/panasonic?region=nac; Supplier: Digikey; Supplier Part Number: P100KGCT-ND; Manufacturer: Panasonic; Manufacturer Part Number: ERJ-3GEYJ104V; RoHS: Yes; Category: Chip SMD Resistors; Stock: 248896; Pricing: 1=0.1, 10=0.033, 50=0.02, 100=0.0165, 500=0.01096, 1000=0.00939 (USD); Mounting Technology: Surface Mount; Case/Package: 0603; Case Code (Imperial): 0603; Case Code (Metric): 1608; Weight: 7.1E-05oz; Contact Plating: Tin; Min Operating Temperature: -55°C; Max Operating Temperature: 155°C; Tolerance: 5%; Packaging: Tape and Reel; Package Quantity: 1; Resistor Type: Thick Film; Termination: SMD/SMT; Number of Terminations: 2; Max Power Dissipation: 100mW; Features: Automotive AEC-Q200; Series: ERJ; Construction: Rectangular; Resistance Tolerance: 5%; Technology: THICK FILM; Length: 1.6mm; Width: 0.8mm; Depth: 0.8mm; Reach SVHC Compliant: No; Military Standard: Not; RoHS Compliant: Yes; ComponentLink1URL: https://datasheet.ciiva.com/11809/0900766b80f806dd-11809567.pdf?src-supplier=Rs; ComponentLink1Description: https://datasheet.ciiva.com/11809/0900766b80f806dd-11809567.pdf?src-supplier=Rs; ComponentLink2URL: https://datasheet.ciiva.com/22758/1678796-22758220.pdf?src-supplier=Farnell; ComponentLink2Description: https://datasheet.ciiva.com/22758/1678796-22758220.pdf?src-supplier=Farnell; ComponentLink3URL: https://datasheet.ciiva.com/43460/1678796-43460761.pdf?src-supplier=Farnell; ComponentLink3Description: https://datasheet.ciiva.com/43460/1678796-43460761.pdf?src-supplier=Farnell; ComponentLink4URL: https://datasheet.ciiva.com/24159/aoa0000ce1-37422-24159717.pdf?src-supplier=Mouser; ComponentLink4Description: https://datasheet.ciiva.com/24159/aoa0000ce1-37422-24159717.pdf?src-supplier=Mouser; ComponentLink5URL: https://datasheet.ciiva.com/46380/1678796-46380412.pdf?src-supplier=Element14; ComponentLink5Description: https://datasheet.ciiva.com/46380/1678796-46380412.pdf?src-supplier=Element14; ComponentLink6URL: https://datasheet.ciiva.com/46389/1678796-46389629.pdf?src-supplier=Element14; ComponentLink6Description: https://datasheet.ciiva.com/46389/1678796-46389629.pdf?src-supplier=Element14; ComponentLink7URL: https://datasheet.ciiva.com/27055/1988495-27055706.pdf?src-supplier=Jameco; ComponentLink7Description: https://datasheet.ciiva.com/27055/1988495-27055706.pdf?src-supplier=Jameco; ComponentLink8URL: https://datasheet.ciiva.com/16762/70255313-16762591.pdf?src-supplier=Allied+Electronics; ComponentLink8Description: https://datasheet.ciiva.com/16762/70255313-16762591.pdf?src-supplier=Allied+Electronics; ComponentLink9URL: https://datasheet.ciiva.com/16508/aoa0000ce1-16508383.pdf?src-supplier=Future+Electronics; ComponentLink9Description: https://datasheet.ciiva.com/16508/aoa0000ce1-16508383.pdf?src-supplier=Future+Electronics
R149 = RT0603BRD0710K4L: 10.4kOhm 0.1% High Precision-High Stability Chip Resistor Thin Film 0603  Paper T/R; Manufacturer: Yageo; Max Power Dissipation: 100mW; Temperature Coefficient: 25ppm/°C; Package: None; Price: None; Value: *; MP: RT0603BRD0710K4L; Availability: Unavailable; Supplier: Digikey; Supplier Part Number: 13-RT0603BRD0710K4LCT-ND; Manufacturer Part Number: RT0603BRD0710K4L; RoHS: Yes; Category: Chip SMD Resistors; Stock: 17618; Pricing: 1=0.14, 10=0.108, 50=0.0868, 100=0.0775, 500=0.06018, 1000=0.05202 (USD); Case/Package: 0603; Min Operating Temperature: -55°C; Max Operating Temperature: 155°C; Tolerance: 0.1%; Packaging: Tape and Reel; Number of Terminations: 2; Series: RT; RoHS Compliant: Yes; ComponentLink1URL: https://datasheet.octopart.com/RT0603BRD0710K4L-Yageo-datasheet-169971040.pdf?src-supplier=Future+Electronics; ComponentLink1Description: https://datasheet.octopart.com/RT0603BRD0710K4L-Yageo-datasheet-169971040.pdf?src-supplier=Future+Electronics; ComponentLink2URL: http://www.yageo.com/documents/recent/PYu-RT_1-to-0.01_RoHS_L_9.pdf?src-supplier=Digikey; ComponentLink2Description: http://www.yageo.com/documents/recent/PYu-RT_1-to-0.01_RoHS_L_9.pdf?src-supplier=Digikey
R150 = CRCW040250K0FKED: 50 kΩ  Tolerance: 1.0%  Power: 63 mW  Package:0402; Manufacturer_Name: Vishay; Datasheet Link: http://www.vishay.com/docs/20035/dcrcwe3.pdf; Height: 0.4mm; Manufacturer_Part_Number: CRCW040250K0FKED; Mouser Part Number: 71-CRCW0402-50K-E3; Mouser Price/Stock: https://www.mouser.co.uk/ProductDetail/Vishay-Dale/CRCW040250K0FKED?qs=ZTJSYgkXUA0CX%252BZe0ESa5A%3D%3D
R151 = CRCW040231K6FKED: 31.6 kΩ  Tolerance: 1.0%  Power: 63 mW; Manufacturer_Name: Vishay; Datasheet Link: http://www.vishay.com/docs/20035/dcrcwe3.pdf; Height: 0.4mm; Manufacturer_Part_Number: CRCW040231K6FKED; Mouser Part Number: 71-CRCW0402-31.6K-E3; Mouser Price/Stock: https://www.mouser.co.uk/ProductDetail/Vishay-Dale/CRCW040231K6FKED?qs=TNtMkGKFKOwWly94NvOrvQ%3D%3D
R152 = CRCW040254K9FKED: 54.9 kΩ  Tolerance: 1.0%  Power: 63 mW  PAckage:0402; Manufacturer_Name: Vishay; Datasheet Link: http://www.vishay.com/docs/20035/dcrcwe3.pdf; Height: 0.4mm; Manufacturer_Part_Number: CRCW040254K9FKED; Mouser Part Number: 71-CRCW0402-54.9K-E3; Mouser Price/Stock: https://www.mouser.co.uk/ProductDetail/Vishay-Dale/CRCW040254K9FKED?qs=hAuyw6LW%252BLi3%2FhCT%2FKiiLw%3D%3D; Arrow Part Number: CRCW040254K9FKED; Arrow Price/Stock: https://www.arrow.com/en/products/crcw040254k9fked/vishay
TP4 = 5006: Test Point Compact THM PC .350 L .125 OD Heat Resistant Nylon 46 Black | Keystone Electronics 5006; MF: Keystone Electronics Corp.; SnapEDA_Link: https://www.snapeda.com/parts/5006/Keystone/view-part/?ref=snap; Package: NON STANDARD-1 Keystone; Value: *; MP: 5006; Check_prices: https://www.snapeda.com/parts/5006/Keystone/view-part/?ref=eda